# EasyEDA Pro project 4090_Portable_Fan.epro, schematic Schematic1_2
Board Name: 单节电池主板; Create Date: 2025-02-24; Page Name: P1; Project Name: 基于STC8G的风扇控制主板; Schematic Name: Schematic1; Update Date: 2025-12-03; BladeWidth: 10; Company: 嘉立创EDA; Page Size: A4; RegionStart: 1; ShowBorder: 1; TitleBlock: 1; TitleBlockPosition: 3; Version: V1.0; XRegionCount: 6; YRegionCount: 4
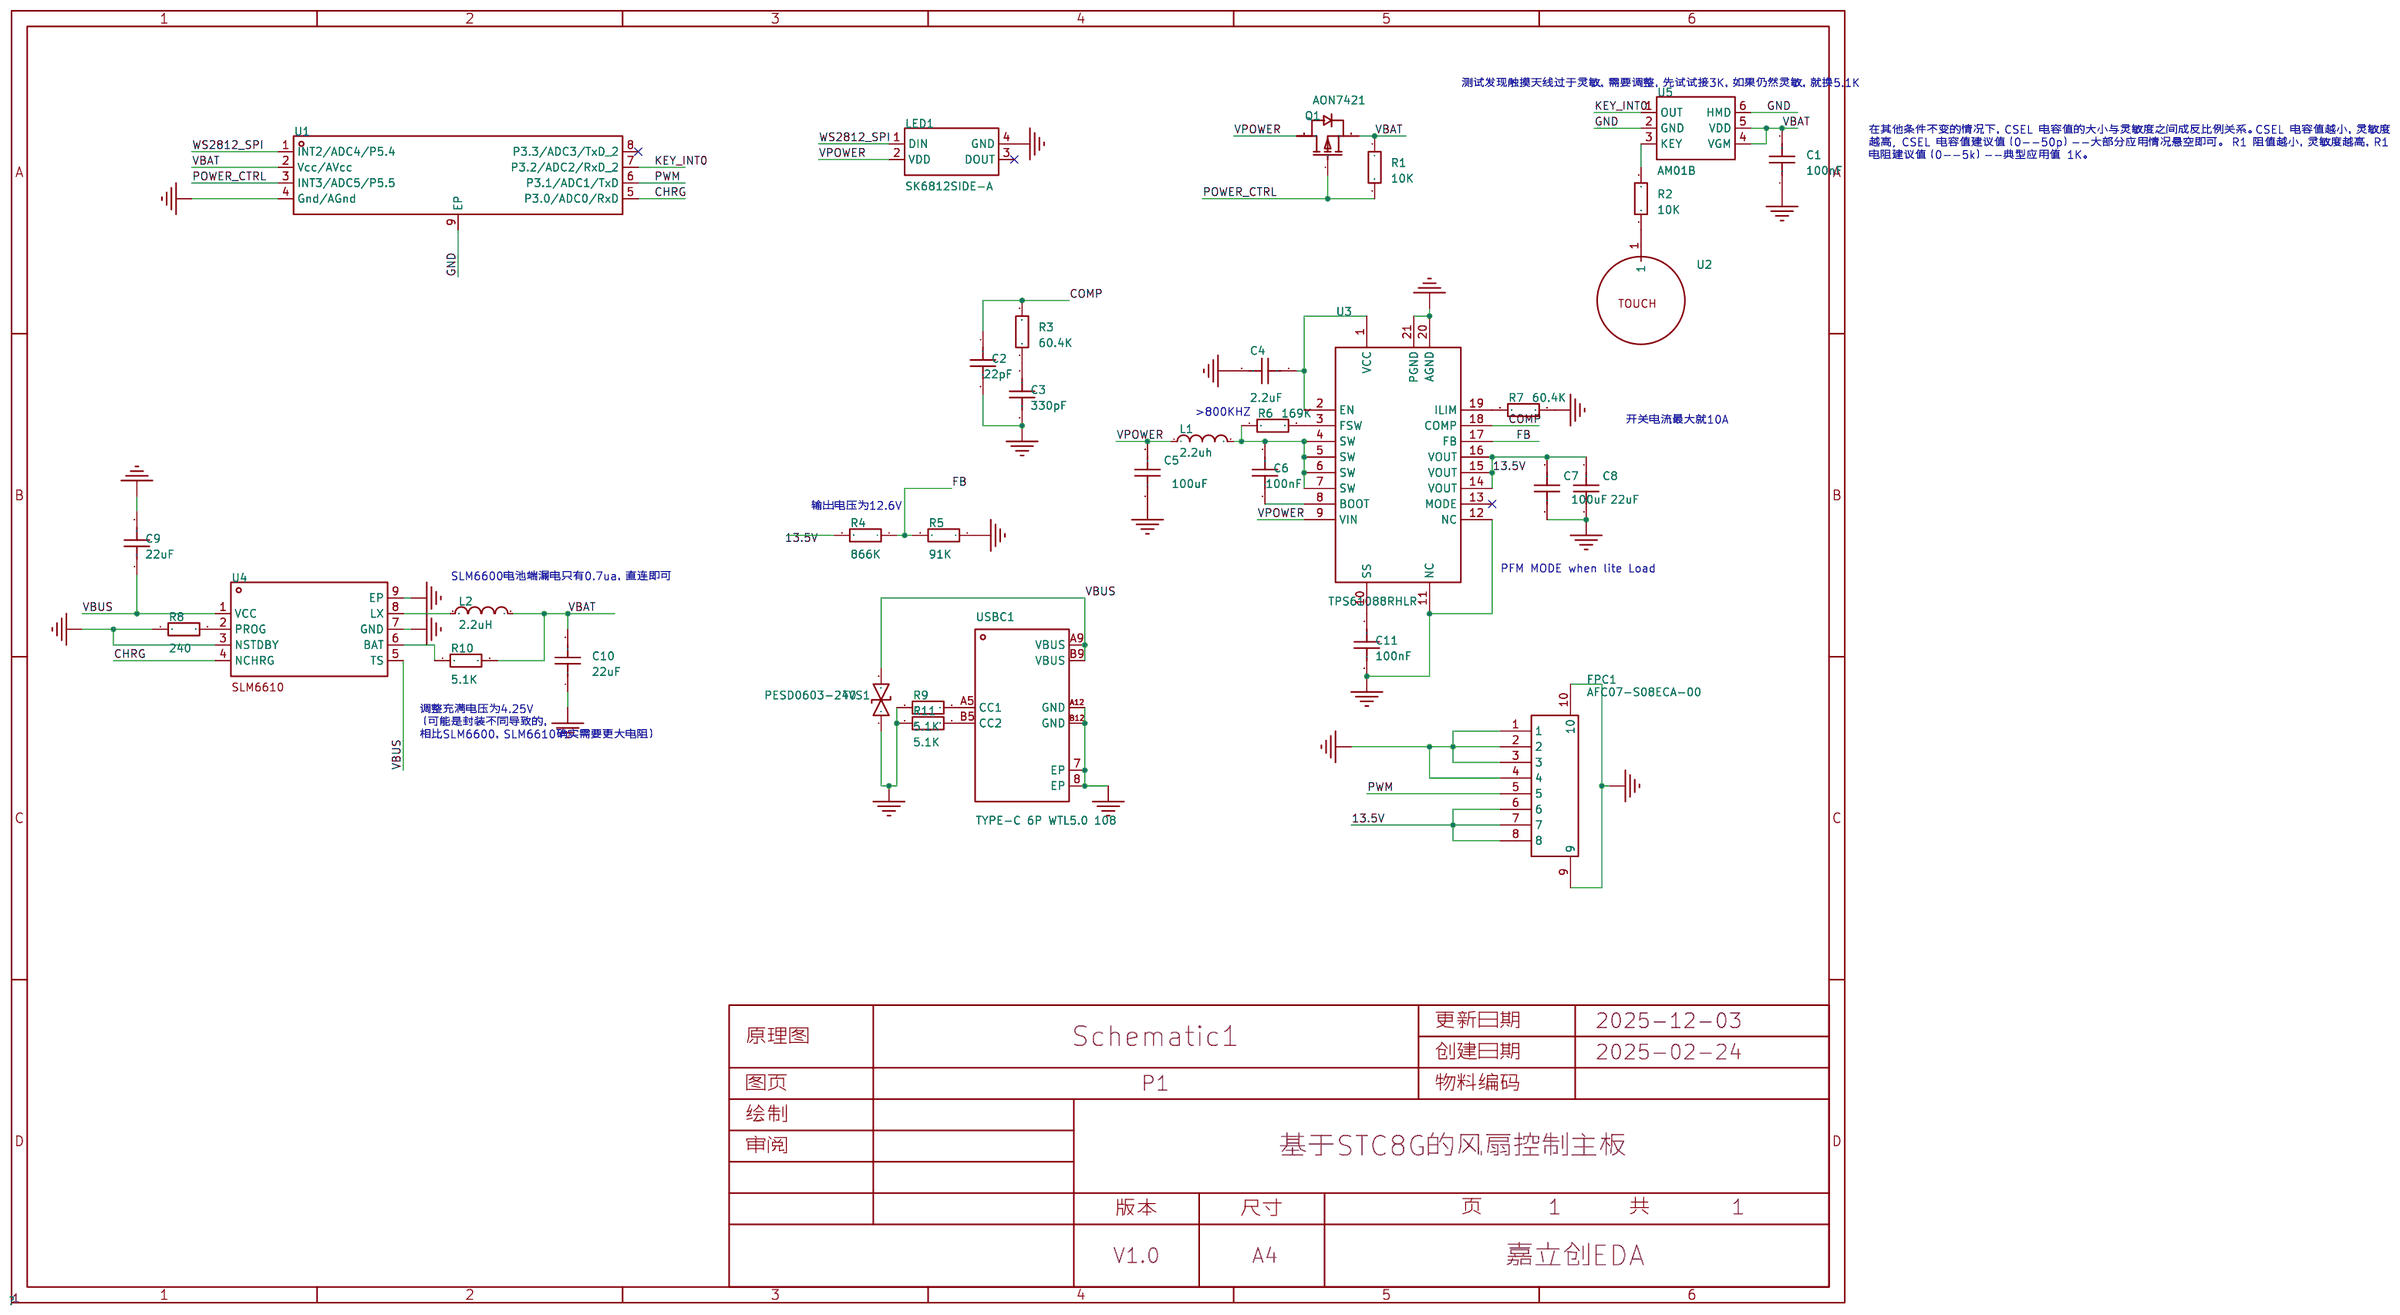
[diagram p1: schematic sheet]

## Parts
C1  100nF  [0805_S]
C2  22pF  [0805_S]
C3  330pF  [0805_S]
C4  2.2uF  [0805_S]
C5  100uF  [C1210]
C6  100nF  [0805_S]
C7  100uF  [C1210]
C8  22uF  [0805_S]
C9  22uF  [0805_S]
C10  22uF  [0805_S]
C11  100nF  [0805_S]
FPC1  AFC07-S08ECA-00  [FPC-SMD_P0.5-8P_LCS-SH-H2.0]
L1  2.2uh  [IND-SMD_L7.0-W6.6_MCW-0650-220]
L2  2.2uH  [IND-SMD_L7.0-W6.6]
LED1  SK6812SIDE-A  [LED-SMD_4P-L4.0-W1.6-L]
Q1  AON7421  [DFN-8_L3.0-W3.0-P0.65-BL]
R1  10K  [0805_S]
R2  10K  [0805_S]
R3  60.4K  [0805_S]
R4  866K  [0805_S]
R5  91K  [0805_S]
R6  169K  [0805_S]
R7  60.4K  [0805_S]
R8  240  [0805_S]
R9  5.1K  [0805_S]
R10  5.1K  [0805_S]
R11  5.1K  [0805_S]
TVS1  PESD0603-240  [D0603-BI]
U1  STC8G1K08A-36I-DFN8  [DFN-8_L3.0-W3.0-P0.50-BL-EP]
U2  -  [F9-10-6-0.4喇叭口无针触摸弹簧]
U3  TPS61088RHLR  [VQFN-20_L4.6-W3.6-P0.50-BL]
U4  -  [DFN-8_L3.0-W3.0-P0.65-BL-EP_AOZ6662DI]
U5  AM01B  [SOT-23-6_L2.9-W1.6-P0.95-LS2.8-BL]
USBC1  TYPE-C 6P WTL5.0 108  [USB-C-SMD_TYPE-C-6P-WTL5.0-108]

## Library data of the parts
C1-C4 C6 C11 = CAP_604: Supplier Footprint: 0603
C5 C7 = HGC1210R5107M160NSVK: 容值:100uF;精度:±20%;额定电压:16V;温度系数:X5R;; LCSC Part Name: 100uF ±20% 16V; Supplier Part: C7432790; Manufacturer: Chinocera(华瓷); Supplier Footprint: 1210; JLCPCB Part Class: Extended Part; Datasheet: https://item.szlcsc.com/datasheet/HGC1210R5107M160NSVK/8438272.html; Supplier: LCSC; Tolerance: ±20%; Voltage Rating: 16V; Temperature Coefficient: X5R
C8-C10 = CAP_0603: Supplier Footprint: 0603
FPC1 = AFC07-S08ECA-00: 锁定特性:抽屉式;触点类型:上接;触点数量:8P;间距:0.5mm;安装类型:卧贴;; LCSC Part Name: 间距:0.5mm P数:8P 抽屉式 上接; Supplier Part: C262581; Manufacturer: JS(钜硕电子); Supplier Footprint: SMD,P=0.5mm,卧贴; JLCPCB Part Class: Extended Part; Datasheet: https://atta.szlcsc.com/upload/public/pdf/source/20190726/C11082_A2E7B12387019CE4314BB5199EE0FDF4.pdf; Supplier: LCSC; Locking Feature: 抽屉式; Contact Type: 上接; Number of Contacts: 8P; Pitch: 0.5mm; Mounting Type: 卧贴; FFC, FCB Thickness: 0.3mm; Height Above Board: 2mm
L1 = FXL0650-2R2-M: 电感值:2.2uH;精度:±20%;额定电流:9A;饱和电流(Isat):11A;类型:一体成型电感;; LCSC Part Name: 2.2uH ±20% 11A; Supplier Part: C475528; Manufacturer: cjiang(长江微电); Supplier Footprint: SMD,6.6x7mm; JLCPCB Part Class: Extended Part; Datasheet: https://atta.szlcsc.com/upload/public/pdf/source/20240426/3189EA8206330E2108542F9E34E540E7.pdf; Supplier: LCSC; Tolerance: ±20%; Rated Current: 9A; Saturation Current (Isat): 11A; DC Resistance (DCR): 12.5mΩ; Type: 一体成型电感
L2 = FXL0630-2R2-M: 电感值:2.2uH;精度:±20%;额定电流:9.5A;饱和电流(Isat):10A;类型:一体成型电感;; LCSC Part Name: 2.2uH ±20% 10A; Supplier Part: C167218; Manufacturer: cjiang(长江微电); Supplier Footprint: SMD,6.6x7mm; JLCPCB Part Class: 扩展库; Datasheet: https://atta.szlcsc.com/upload/public/pdf/source/20240426/3189EA8206330E2108542F9E34E540E7.pdf; Supplier: LCSC; Tolerance: ±20%; Rated Current: 9.5A; Saturation Current (Isat): 10A; DC Resistance (DCR): 15mΩ; Type: 一体成型电感
LED1 = SK6812SIDE-A_C5378721: Supplier Part: C5378721; Manufacturer: 欧思科光电; Supplier Footprint: SMD-4P,4x1.6mm; JLCPCB Part Class: Extended Part; Datasheet: https://item.szlcsc.com/datasheet/SK6812SIDE-A/6242292.html; Supplier: LCSC
Q1 = ASDM30P11TD-R: 数量:1个P沟道;漏源电压(Vdss):30V;连续漏极电流(Id):55A;导通电阻(RDS(on)):8mΩ@10V;耗散功率(Pd):31.2W;阈值电压(Vgs(th)):2.5V@250uA;; LCSC Part Name: P沟道,电流:-55A,耐压:-30V; Supplier Part: C2758227; Manufacturer: ASDsemi(安森德); Supplier Footprint: DFN-8(3x3); JLCPCB Part Class: 扩展库; Datasheet: https://item.szlcsc.com/datasheet/ASDM30P11TD-R/2875934.html; Supplier: LCSC; Number: 1个P沟道; Drain to Source Voltage: 30V; Current - Continuous Drain(Id): 55A; RDS(on): 8mΩ@10V; Pd - Power Dissipation: 31.2W; Gate Threshold Voltage (Vgs(th)): 2.5V@250uA; Gate Charge(Qg): 61nC@10V; Input Capacitance(Ciss): 3.482nF; Reverse Transfer Capacitance (Crss@Vds): 309pF; Operating Temperature: -55℃~+150℃; Type: P沟道; Output Capacitance(Coss): 400pF
R1 R8-R11 = Res_0603: Supplier Footprint: 0603
R2-R7 = Res_604: Supplier Footprint: 0603
TVS1 = PESD0603-240_C2929617: 钳位电压:45V;击穿电压:-;; Supplier Part: C2929617; Manufacturer: Littelfuse(美国力特); Supplier Footprint: 0603; JLCPCB Part Class: 扩展库; Datasheet: https://atta.szlcsc.com/upload/public/pdf/source/20180516/C207186_7CE2F9DCABF8CE4AA3105E54FFDB24F6.pdf; Supplier: LCSC; Clamping Voltage: 45V; Number of Channels: 单路; Type: ESD
U1 = STC8G1K08A-36I-DFN8: CPU内核:51系列;应用领域:-;; Supplier Part: C915664; Manufacturer: STC; Supplier Footprint: DFN-8-EP(3x3); JLCPCB Part Class: 扩展库; Datasheet: https://atta.szlcsc.com/upload/public/pdf/source/20241226/1556D7EB67C0BC8C1661C3E278549CA4.pdf; Supplier: LCSC; CPU Core: 51系列; Program Storage Size: 8KB; Program Memory Type: FLASH
U2 = F9-10-6-0.4喇叭口无针触摸弹簧
U3 = TPS61088RHLR: 功能类型:升压型;输出类型:可调;工作电压:2.7V~12V;输出电压:4.5V~12.6V;输出电流:10A;; LCSC Part Name: 全集成同步升压转换器; Supplier Part: C87357; Manufacturer: TI(德州仪器); Supplier Footprint: VQFN-20-EP(3.6x4.6); JLCPCB Part Class: Extended Part; Datasheet: https://www.ti.com/cn/lit/gpn/tps61088; Supplier: LCSC; Function: 升压型; Output Type: 可调; Input Voltage: 2.7V~12V; Output Voltage: 4.5V~12.6V; Output Current: 10A; Switching Frequency: 200kHz~2.2MHz; Operating Temperature: -40℃~+85℃; Synchronous Rectification: 是; Number of Outputs: 1; Topology: 升压式; Switch tube (built-in/external): 内置
U4 = SLM6610: 5V3A同步降压，单节锂电池充电芯片
U5 = AM01B: 通道数:1;芯片功能:电容式触摸;是否自锁:是;; Supplier Part: C485387; Manufacturer: XMXW(芯网); Supplier Footprint: SOT-23-6L; JLCPCB Part Class: Extended Part; Datasheet: https://item.szlcsc.com/datasheet/AM01B/493832.html; Supplier: LCSC; Number of Channels: 1; Chip Function: 电容式触摸; Whether the Lock: 是; Voltage - Supply: 2.3V~5.5V; Current - Supply: 5uA; Operating Temperature: -20℃~+85℃
USBC1 = TYPE-C 6P WTL5.0 108: 连接器类型:Type-C;公母:母;安装方式:卧贴;触点数量:6P;端口数量:1;额定电流 - 电源:3A;工作温度范围:-20℃~+85℃;; LCSC Part Name: Type-C 母 卧贴; Supplier Part: C30167323; Manufacturer: SHOU HAN(首韩); Supplier Footprint: SMD; JLCPCB Part Class: 扩展库; Datasheet: https://atta.szlcsc.com/upload/public/pdf/source/20240719/5FA0E35FE16D69FE6470A929035FA38A.pdf; Supplier: LCSC; Connector Type: Type-C; Gender: 母; Mounting Style: 卧贴; Number of Contacts: 6P; Number of Ports: 1; Current Rating - Power (Max): 3A; Rated Voltage (Max): 5V; Connect-Disconnect Life: 5千次; Length: 5mm; Core Colour: 黑色; Operating Temperature Range: -20℃~+85℃

## Nets
13.5V: C7.2 C8.1 FPC1.6 FPC1.7 FPC1.8 R4.2 U3.14(VOUT) U3.15(VOUT) U3.16(VOUT)
GND: C1.1 C2.2 C3.2 C4.2 C5.1 C7.1 C8.2 C9.2 C10.1 C11.2 FPC1.1 FPC1.2 FPC1.3 FPC1.4 FPC1.9 FPC1.10 LED1.4(GND) R5.1 R7.2 R8.1 R9.1 R11.1 TVS1.1 U1.4(Gnd/AGnd) U1.9(EP) U3.11(NC) U3.12(NC) U3.20(AGND) U3.21(PGND) U4.3(NSTDBY) U4.7(GND) U4.9(EP) U5.2(GND) U5.6(HMD) USBC1.7(EP) USBC1.8(EP) USBC1.A12(GND) USBC1.B12(GND)
VBAT: C1.2 C10.2 L2.2 Q1.1(S) Q1.2(S) Q1.3(S) R1.1 R10.2 U1.2(Vcc/AVcc) U5.4(VGM) U5.5(VDD)
VBUS: C9.1 TVS1.2 U4.1(VCC) U4.5(TS) USBC1.A9(VBUS) USBC1.B9(VBUS)
CHRG: U1.5(P3.0/ADC0/RxD) U4.4(NCHRG)
COMP: C2.1 R3.2 U3.18(COMP)
FB: R4.1 R5.2 U3.17(FB)
KEY_INT0: U1.7(P3.2/ADC2/RxD_2) U5.1(OUT)
POWER_CTRL: Q1.4(G) R1.2 U1.3(INT3/ADC5/P5.5)
PWM: FPC1.5 U1.6(P3.1/ADC1/TxD)
VPOWER: C5.2 L1.1 LED1.2(VDD) Q1.5(D) Q1.6(D) Q1.7(D) Q1.8(D) Q1.9(D) U3.9(VIN)
WS2812_SPI: LED1.1(DIN) U1.1(INT2/ADC4/P5.4)
$1N19622: R9.2 USBC1.A5(CC1)
$1N19624: R11.2 USBC1.B5(CC2)
$1N43193: C3.1 R3.1
$1N43198: R2.2 U5.3(KEY)
$1N43227: C6.1 L1.2 R6.1 U3.4(SW) U3.5(SW) U3.6(SW) U3.7(SW)
$1N43235: R10.1 U4.6(BAT)
$1N43239: L2.1 U4.8(LX)
$1N43243: R8.2 U4.2(PROG)
$1N43246: C4.1 U3.1(VCC) U3.2(EN)
$1N43249: R6.2 U3.3(FSW)
$1N43260: R7.1 U3.19(ILIM)
$1N43262: C6.2 U3.8(BOOT)
$1N43264: C11.1 U3.10(SS)
$1N43270: R2.1 U2.1

Not connected (* = marked no-connect by the designer): LED1 3(DOUT)*; U1 8(P3.3/ADC3/TxD_2)*; U3 13(MODE)*

## Notes on the sheet
- 测试发现触摸天线过于灵敏，需要调整，先试试接3K，如果仍然灵敏，就换5.1K
- 在其他条件不变的情况下，CSEL 电容值的大小与灵敏度之间成反比例关系。CSEL 电容值越小，灵敏度
  越高, CSEL 电容值建议值（0--50p）--大部分应用情况悬空即可。 R1 阻值越小，灵敏度越高，R1
  电阻建议值（0--5k）--典型应用值 1K。
- >800KHZ
- 开关电流最大就10A
- 输出电压为12.6V
- PFM MODE when lite Load
- SLM6600电池端漏电只有0.7ua，直连即可
- 调整充满电压为4.25V
  （可能是封装不同导致的，
  相比SLM6600，SLM6610确实需要更大电阻）
